# EAGLE design max6_breakout_lc (EAGLE 6.1)
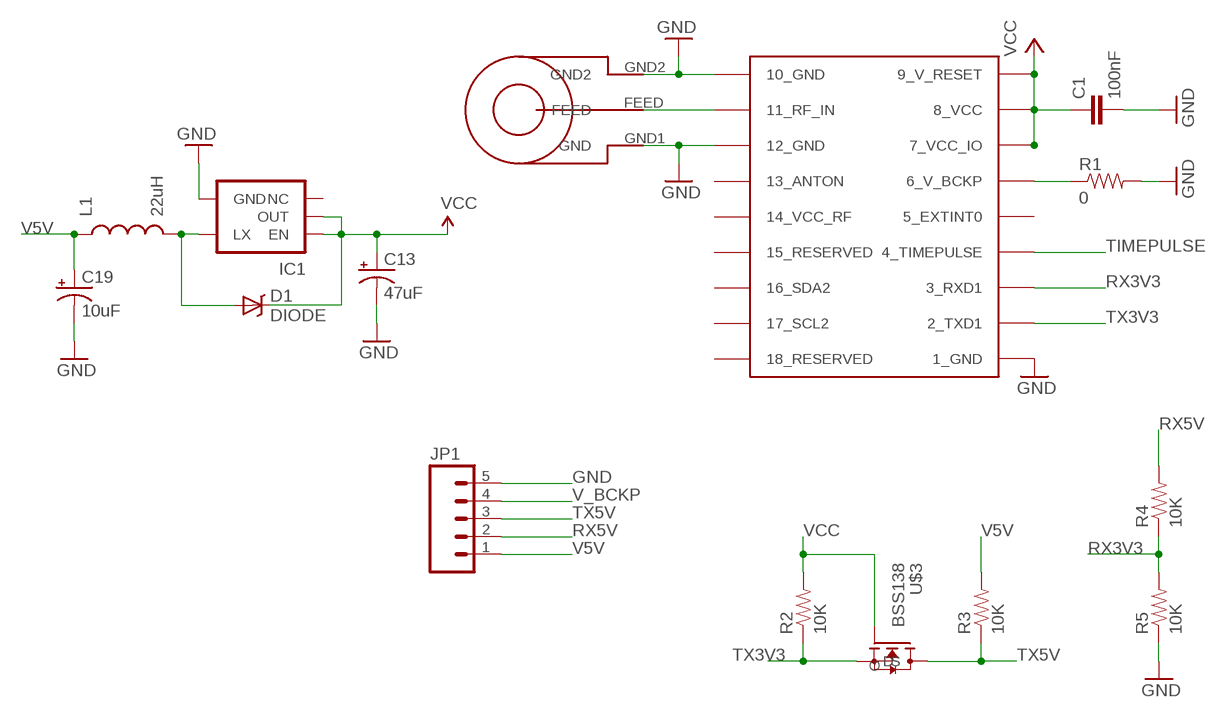
[diagram p0: schematic, sheet 1]

## Parts
C1  100nF  CAP0603-CAP  [0603-CAP]
C13  47uF  CAP_POL1206  [EIA3216]
C19  10uF  CAP_POL1206  [EIA3216]
D1  DIODE  DIODE-SCHOTTKY_  [SMA-DIODE]
IC1  V_REG_NCP1400SOT23-5  [SOT23-5]
JP1  M05PTH  [1X05]
L1  22uH  INDUCTOR1210  [1210]
R1  0  RESISTOR0603-RES  [0603-RES]
R2  10K  RESISTOR0603-RES  [0603-RES]
R3  10K  RESISTOR0603-RES  [0603-RES]
R4  10K  RESISTOR0603-RES  [0603-RES]
R5  10K  RESISTOR0603-RES  [0603-RES]
U$1  UBLOX_MAX-6  [UBLOX_MAX-6]
U$2  SARANTEL-SR1202  [SARANTEL-SR1202]
U$3  BSS138  [BSS138]

## Nets
3.3V: C13.A(+) D1.C IC1.1(EN) IC1.2(OUT) ; supply symbol labelled VCC
GND: C1.2 C13.C(-) C19.C(-) IC1.4(GND) JP1.5 R1.2 R5.1 U$1.1_GND U$1.10_GND U$1.12_GND U$2.GND1(GND) U$2.GND2
N$2: U$1.11_RF_IN U$2.FEED
N$11: D1.A IC1.5(LX) L1.2
RX3V3: R4.1 R5.2 U$1.3_RXD1
RX5V: JP1.2 R4.2
TIMEPULSE: U$1.4_TIMEPULSE
TX3V3: R2.1 U$1.2_TXD1 U$3.S
TX5V: JP1.3 R3.1 U$3.D
V5V: C19.A(+) JP1.1 L1.1 R3.2
V_BCKP: JP1.4 R1.1 U$1.6_V_BCKP
VCC: C1.1 R2.2 U$1.7_VCC_IO U$1.8_VCC U$1.9_V_RESET U$3.G
Unconnected: IC1.3(NC) U$1.5_EXTINT0 U$1.13_ANTON U$1.14_VCC_RF U$1.15_RESERVED U$1.16_SDA2 U$1.17_SCL2 U$1.18_RESERVED

## Library data of the parts
C1 = SparkFun:CAP: Capacitor Standard 0603 ceramic capacitor, and 0.1" leaded capacitor.
C13 C19 = SparkFun:CAP_POL: Capacitor Polarized These are standard SMD and PTH capacitors. Normally 10uF, 47uF, and 100uF in electrolytic and tantalum varieties. Always verify the external diameter of the through hole cap, it varies with capacity, voltage, and manufacturer. The EIA devices should be standard.
D1 = SparkFun:DIODE-SCHOTTKY
IC1 = SparkFun:V_REG_NCP1400: Switching step-up voltage regulator NCP1400 switiching regulator takes single cell AA and outputs 100mA at 3.3V or 5V with minimal number of external components.
JP1 = SparkFun:M05: Header 5 Standard 5-pin 0.1" header. Use with straight break away headers (SKU : PRT-00116), right angle break away headers (PRT-00553), swiss pins (PRT-00743), machine pins (PRT-00117), and female headers (PRT-00115). Molex polarized connector foot print use with SKU : PRT-08230 with associated crimp pins and housings.
L1 = SparkFun:INDUCTOR: Inductors Basic Inductor/Choke - 0603 and 1206. Footprints are not proven and vary greatly between part numbers.
R1-R5 = SparkFun:RESISTOR: Resistor Basic schematic elements and footprints for 0603, 1206, and PTH resistors.
U$1 = ava:UBLOX_MAX-6: UBLOX MAX-6
U$2 = ava:SARANTEL-SR1202: SARANTEL-SL1202 Author Anthony Stirk / http://ava.upuaut.net Data Sheet : http://docs-europe.electrocomponents.com/webdocs/0dbd/0900766b80dbde80.pdf
U$3 = ava:BSS138: BSS138 N-Channel Logic Level Enhancement Mode Field Effect Transistor

## Net classes
0 default: width 0.203 mm
1 vcc: width 0.254 mm

## Board
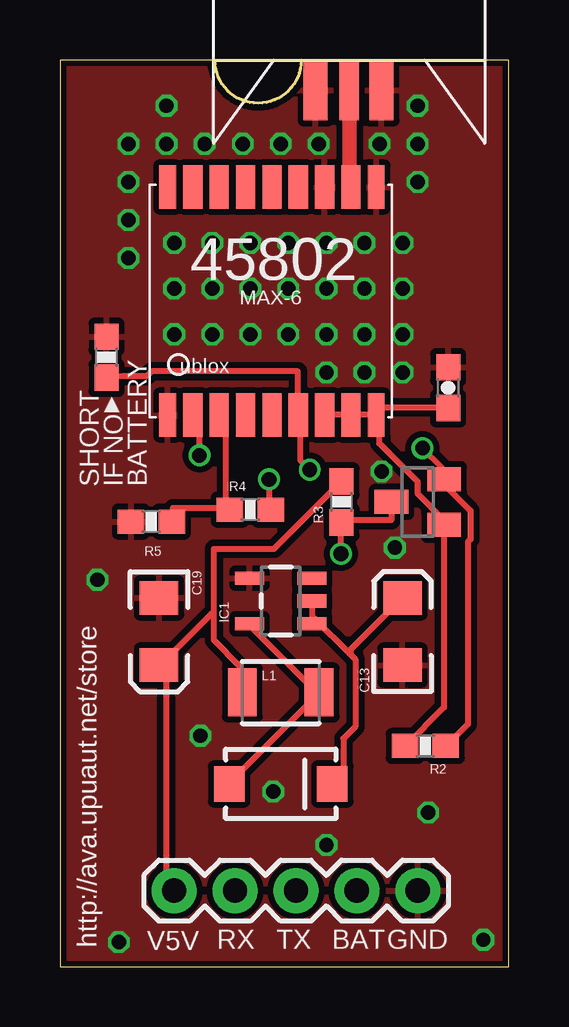
[diagram p1: board, top side]
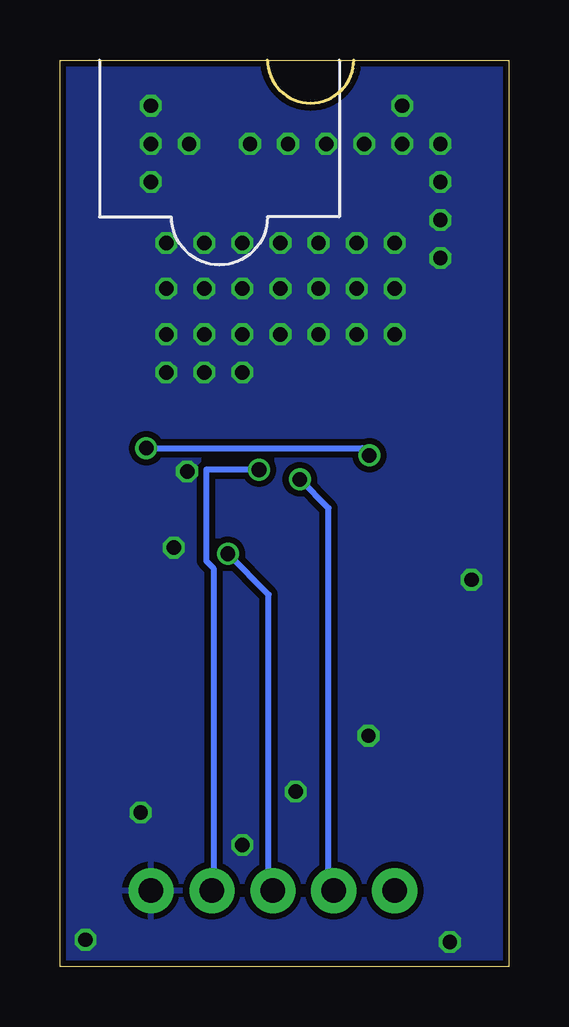
[diagram p2: board, bottom side, seen from below]

Size 18.72 x 37.78 mm. Coordinates in mm from the lower left corner, seen from the top.
Outline: 0,0 18.72,0 18.72,37.77 0,37.77 0,0
Copper layers (1*16): Top 0.035mm / dielectric 1.5mm / Bottom 0.035mm
Design rules: minimum track width 6mil, minimum drill 12mil, track to track 6mil, track to pad 6mil, pad to pad 6mil, via to via 6mil, smd to smd 0mil, copper to edge 10mil, drill to drill 10mil, minimum pad ring 10mil, minimum via ring 6mil, stop-mask expansion 2mil, vias tented up to drill 100mil, thermal gap 10mil

### Footprints (pad centres in the part's own frame; a part is rotated, then mirrored left to right if it is on the bottom)
0603-CAP = smd 1.1 x 1: 1 -0.85,0; 2 0.85,0
EIA3216 = smd 1.4 x 1.6: A 1.4,0; C -1.4,0
SMA-DIODE = smd 1.27 x 1.47: A -2.15,0; C 2.15,0
SOT23-5 = smd 0.55 x 1.2: 1 -0.95,-1.3; 2 0,-1.3; 3 0.95,-1.3; 4 0.95,1.3; 5 -0.95,1.3
1X05 = drill 1.016 pad 1.88: 1 0,0; 2 2.54,0; 3 5.08,0; 4 7.62,0; 5 10.16,0
1210 = smd 1.2 x 2: 1 -1.6,0; 2 1.6,0
0603-RES = smd 1.1 x 1: 1 -0.85,0; 2 0.85,0
UBLOX_MAX-6 = smd 1.8 x 0.7: 1_GND 4.95,-4.4; 9_V_RESET 4.95,4.3; 10_GND -4.55,4.3; 18_RESERVED -4.55,-4.4 | smd 1.8 x 0.8: 2_TXD1 4.95,-3.35; 3_RXD1 4.95,-2.25; 4_TIMEPULSE 4.95,-1.15; 5_EXTINT0 4.95,-0.05; 6_V_BCKP 4.95,1.05; 7_VCC_IO 4.95,2.15; 8_VCC 4.95,3.25; 11_RF_IN -4.55,3.25; 12_GND -4.55,2.15; 13_ANTON -4.55,1.05; 14_VCC_RF -4.55,-0.05; 15_RESERVED -4.55,-1.15; 16_SDA2 -4.55,-2.25; 17_SCL2 -4.55,-3.35
SARANTEL-SR1202 = smd 2.5 x 0.8: FEED 0,0 | smd 2.5 x 1: GND1 0,1.4; GND2 0,-1.35
BSS138 = smd 1 x 1.4: D 0,1.1; G -0.95,-1.1; S 0.95,-1.1

### Placement (x,y rotation side)
C1  16.19,24.13 90 top
C13  14.29,13.97 90 top
C19  4.13,13.97 270 top
D1  9.21,7.62 0 top
IC1  9.21,15.24 90 top
JP1  4.76,3.18 0 top
L1  9.21,11.43 0 top
R1  1.94,25.4 90 top
R2  15.24,9.21 180 top
R3  11.75,19.37 90 top
R4  7.94,19.05 0 top
R5  3.81,18.55 0 top
U$1  8.89,27.94 270 top
U$2  12.07,36.51 90 top
U$3  14.92,19.37 90 top

### Tracks (layer width: path | path; a pad name or v marks a point on that pad's centre or on a via)
3.3V
  Top 0.254: IC1.2 10.52,15.21 10.52,14.31 IC1.1 10.62,14.51 12.07,13.06 | 12.07,13.06 12.32,12.81 12.32,10.01 11.82,9.51 11.82,8.11 11.42,7.71 D1.C | C13.A 14.22,15.31 12.12,13.21 12.12,13.11 12.07,13.06
GND  (via drill 0.6)
  other vias: 8.89,7.3 11.11,5.08 4.76,28.26 4.76,26.35 4.76,30.16 6.35,28.26 6.35,26.35 6.35,30.16 7.94,28.26 7.94,26.35 7.94,30.16 9.53,28.26 9.53,26.35 9.53,30.16 11.11,28.26 11.11,26.35 11.11,30.16 11.11,24.76 12.7,24.76 14.29,24.76 12.7,28.26 12.7,26.35 12.7,30.16 14.29,28.26 14.29,26.35 14.29,30.16 14.92,35.88 10.79,34.29 13.34,34.29 14.92,34.29 14.92,32.7 9.21,34.29 7.62,34.29 6.03,34.29 4.45,34.29 4.45,35.88 2.86,31.11 2.86,34.29 2.86,32.7 2.86,29.53 13.97,17.46 13.42,20.64 2.46,1.03 17.66,1.13 15.36,6.43 5.86,9.63 1.56,16.13
  pour Top (isolate 0.254): 0,37.78 18.73,37.78 18.73,37.47 18.73,-0.95 0,-0.95
  pour Bottom (isolate 0.254): 0,37.78 18.73,37.78 18.73,37.47 18.73,-0.95 0,-0.95
N$2
  Top 0.406: 12.07,32.7 12.14,32.7 U$1.11_RF_IN
  Top 0.61: U$2.FEED 12.07,32.7
N$11
  Top 0.254: IC1.5 7.92,14.21 10.72,11.41 L1.2 10.72,11.31 7.12,7.71 D1.A
RX3V3
  Top 0.254: R5.2 4.72,19.11 7.02,19.11 R4.1 6.92,19.21 6.92,22.71 6.72,22.91 U$1.3_RXD1
RX5V  (via drill 0.61)
  Top 0.254: v8.72,20.31 8.72,19.11 R4.2
  Bottom 0.254: v8.72,20.31 7.52,19.11 7.52,3.21 7.32,3.21 JP1.2
TX3V3  (via drill 0.61)
  Top 0.254: R2.1 16.12,9.21 17.02,10.11 17.02,17.71 17.12,17.81 17.12,19.01 16.12,20.01 16.12,20.31 U$3.S 15.92,20.31 15.92,20.81 v15.12,21.61 | v5.82,21.31 5.82,22.71 5.62,22.91 U$1.2_TXD1
  Bottom 0.254: v5.82,21.31 6.12,21.61 v15.12,21.61
TX5V  (via drill 0.61)
  Top 0.254: U$3.D 13.82,19.31 13.82,18.61 11.82,18.61 R3.1 11.72,18.41 v11.72,17.21
  Bottom 0.254: v11.72,17.21 10.02,15.51 10.02,3.21 9.92,3.21 JP1.3
V5V
  Top 0.254: 6.42,14.71 6.42,13.61 7.52,12.51 7.52,11.51 L1.1 | 6.42,14.71 6.42,17.41 8.92,17.41 11.72,20.21 R3.2 | 6.42,14.71 6.32,14.71 4.22,12.61 C19.A 4.42,12.71 4.42,3.51 4.72,3.21 JP1.1
V_BCKP  (via drill 0.61)
  Top 0.254: R1.1 2.62,24.61 3.62,24.61 3.82,24.81 9.92,24.81 9.92,23.01 U$1.6_V_BCKP 10.02,22.91 10.02,21.11 v10.42,20.71
  Bottom 0.254: v10.42,20.71 12.62,20.71 12.62,16.91 12.32,16.61 12.32,3.21 JP1.4
VCC
  Top 0.254: U$1.7_VCC_IO 11.12,23.01 12.12,23.01 U$1.8_VCC 12.22,23.01 13.12,23.01 U$1.9_V_RESET | C1.1 16.12,23.31 13.22,23.31 13.22,23.01 U$1.9_V_RESET | R2.2 14.42,9.21 16.02,10.81 U$3.G 16.02,18.51 16.02,18.61 14.92,19.71 14.92,20.21 13.32,21.81 13.32,22.81 13.22,22.91 U$1.9_V_RESET

### Text on the board
tPlace: 45802 | ▲ | SHORT | IF NO | BATTERY | http://ava.upuaut.net/store | V5V | RX | TX | BAT | GND